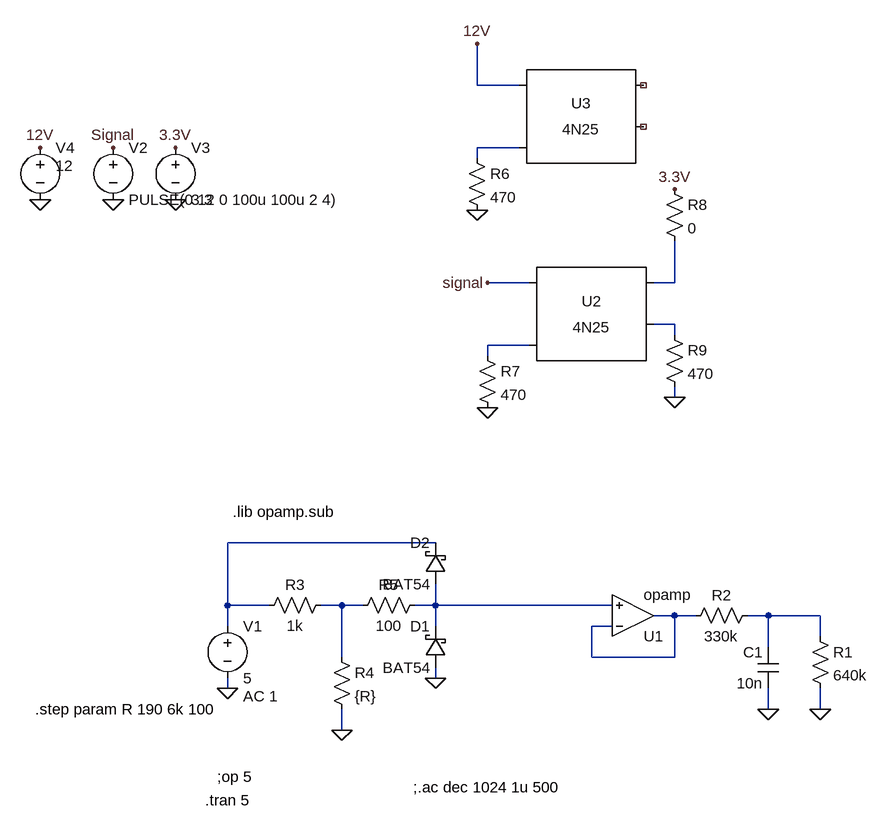
[diagram p0: schematic inputs_sim.asc]
inputs_sim.asc, the LTspice schematic file:
Version 4
SHEET 1 952 680
WIRE 64 -672 64 -736
WIRE 128 -672 64 -672
WIRE 128 -576 64 -576
WIRE 64 -560 64 -576
WIRE 144 -368 80 -368
WIRE 368 -368 368 -432
WIRE 368 -368 336 -368
WIRE 368 -304 336 -304
WIRE 368 -288 368 -304
WIRE 144 -272 80 -272
WIRE 80 -256 80 -272
WIRE 368 -192 368 -208
WIRE 0 32 -320 32
WIRE -320 128 -320 32
WIRE -256 128 -320 128
WIRE -144 128 -176 128
WIRE -112 128 -144 128
WIRE 0 128 0 96
WIRE 0 128 -32 128
WIRE 272 128 0 128
WIRE 368 144 336 144
WIRE 400 144 368 144
WIRE 512 144 480 144
WIRE 592 144 512 144
WIRE -320 160 -320 128
WIRE 0 160 0 128
WIRE 272 160 240 160
WIRE 592 176 592 144
WIRE 512 192 512 144
WIRE -144 208 -144 128
WIRE 240 208 240 160
WIRE 368 208 368 144
WIRE 368 208 240 208
WIRE 0 240 0 224
WIRE 0 240 -16 240
WIRE -320 256 -320 240
WIRE 512 288 512 256
WIRE 592 288 592 256
WIRE -144 320 -144 288
FLAG 512 288 0
FLAG -320 256 0
FLAG -144 320 0
FLAG 0 240 0
FLAG 592 288 0
FLAG -496 -496 0
FLAG -496 -576 Signal
FLAG -400 -496 0
FLAG -400 -576 3.3V
FLAG 64 -480 0
FLAG 80 -176 0
FLAG 80 -368 signal
FLAG 368 -192 0
FLAG 368 -512 3.3V
FLAG -608 -496 0
FLAG -608 -576 12V
FLAG 64 -736 12V
DATAFLAG 480 144 ""
SYMBOL Opamps\\opamp 304 208 M180
SYMATTR InstName U1
SYMBOL res 496 128 R90
WINDOW 0 0 56 VBottom 2
WINDOW 3 32 56 VTop 2
SYMATTR InstName R2
SYMATTR Value 330k
SYMBOL cap 528 256 R180
WINDOW 0 24 56 Left 2
WINDOW 3 24 8 Left 2
SYMATTR InstName C1
SYMATTR Value 10n
SYMBOL voltage -320 144 R0
WINDOW 123 24 124 Left 2
WINDOW 39 0 0 Left 0
SYMATTR InstName V1
SYMATTR Value 5
SYMATTR Value2 AC 1
SYMBOL res -160 112 R90
WINDOW 0 0 56 VBottom 2
WINDOW 3 32 56 VTop 2
SYMATTR InstName R3
SYMATTR Value 1k
SYMBOL res -160 192 R0
SYMATTR InstName R4
SYMATTR Value {R}
SYMBOL schottky 16 224 R180
WINDOW 0 24 64 Left 2
WINDOW 3 24 0 Left 2
SYMATTR InstName D1
SYMATTR Value BAT54
SYMATTR Description Zener Diode
SYMATTR Type zener
SYMBOL schottky 16 96 R180
WINDOW 0 24 64 Left 2
WINDOW 3 24 0 Left 2
SYMATTR InstName D2
SYMATTR Value BAT54
SYMATTR Description Zener Diode
SYMATTR Type zener
SYMBOL res -16 112 R90
WINDOW 0 0 56 VBottom 2
WINDOW 3 32 56 VTop 2
SYMATTR InstName R5
SYMATTR Value 100
SYMBOL res 576 160 R0
SYMATTR InstName R1
SYMATTR Value 640k
SYMBOL Optos\\4N25 240 -304 R0
SYMATTR InstName U2
SYMBOL voltage -496 -592 R0
WINDOW 123 0 0 Left 0
WINDOW 39 0 0 Left 0
SYMATTR InstName V2
SYMATTR Value PULSE(0 12 0 100u 100u 2 4)
SYMBOL voltage -400 -592 R0
WINDOW 123 0 0 Left 0
WINDOW 39 0 0 Left 0
SYMATTR InstName V3
SYMATTR Value 3.3
SYMBOL Optos\\4N25 224 -608 R0
SYMATTR InstName U3
SYMBOL res 48 -576 R0
SYMATTR InstName R6
SYMATTR Value 470
SYMBOL res 64 -272 R0
SYMATTR InstName R7
SYMATTR Value 470
SYMBOL res 352 -528 R0
SYMATTR InstName R8
SYMATTR Value 0
SYMBOL voltage -608 -592 R0
WINDOW 3 24 44 Left 2
WINDOW 123 0 0 Left 0
WINDOW 39 0 0 Left 0
SYMATTR InstName V4
SYMATTR Value 12
SYMBOL res 352 -304 R0
SYMATTR InstName R9
SYMATTR Value 470
TEXT -34 408 Left 2 !;.ac dec 1024 1u 500
TEXT -312 -16 Left 2 !.lib opamp.sub
TEXT -354 428 Left 2 !.tran 5
TEXT -616 288 Left 2 !.step param R 190 6k 100
TEXT -336 392 Left 2 !;op 5

The netlist it stands for:
* inputs_sim.asc
XU1 N008 N007 N008 opamp Aol=100K GBW=10Meg  ; pins invin noninvin out
R2 N009 N008 330k
C1 0 N009 10n
V1 N005 0 5 AC 1
R3 N006 N005 1k
R4 N006 0 {R}
D1 0 N007 BAT54
D2 N007 N005 BAT54
R5 N007 N006 100
R1 N009 0 640k
XU2 Signal N004 N002 N003 NC_01 4N25
V2 Signal 0 PULSE(0 12 0 100u 100u 2 4)
V3 3.3V 0 3.3
XU3 12V N001 NC_02 NC_03 NC_04 4N25
R6 N001 0 470
R7 N004 0 470
R8 3.3V N002 0
V4 12V 0 12
R9 N003 0 470
.model D D
.lib standard.dio
;.ac dec 1024 1u 500
.lib opamp.sub
.tran 5
.step param R 190 6k 100
;op 5
.lib 4N25.sub
.backanno
.end